# Altium schematic sheet Sheet2.SchDoc
size A3
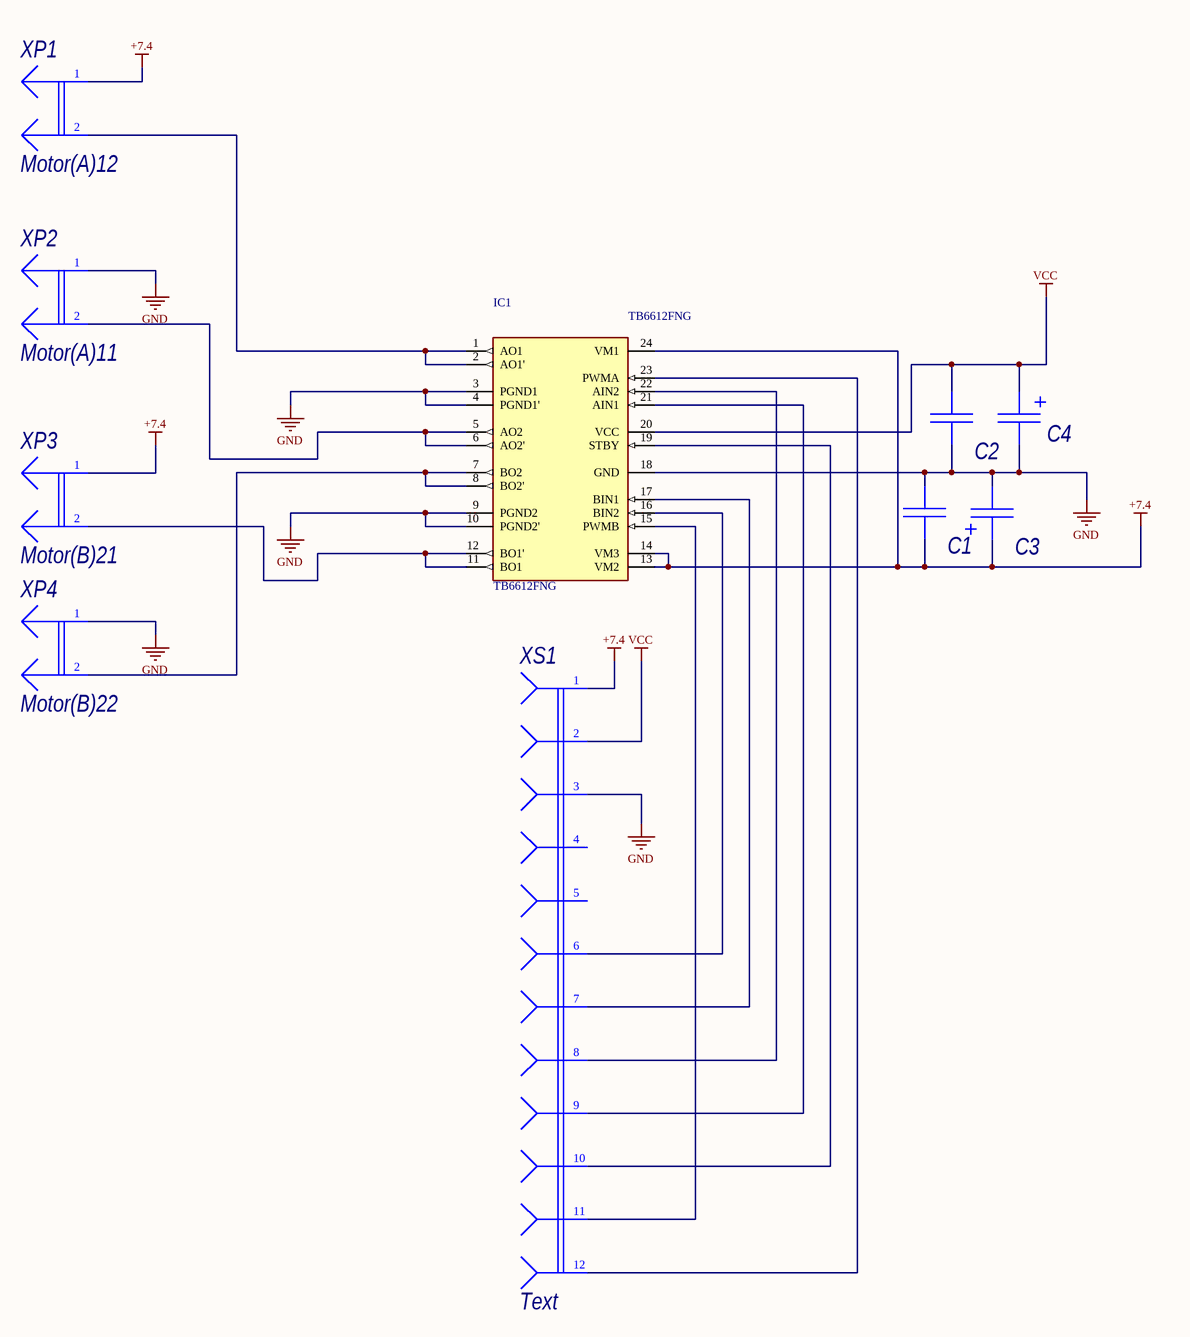
[diagram p0: Sheet2.SchDoc]

## Parts
C1  Capacitor  [C0603]  (value not drawn)
C2  Capacitor  [C0603]  (value not drawn)
C3  Capacitor-T  [C3216-p]  (value not drawn)
C4  Capacitor-T  [C3216-p]  (value not drawn)
IC1  TB6612FNG  [SSOP24]
XP1  Motor(A)12  [PLS-2]
XP2  Motor(A)11  [PLS-2]
XP3  Motor(B)21  [PLS-2]
XP4  Motor(B)22  [PLS-2]
XS1  Text  [PBS-12]

## Nets
+7.4: C1.1 C3.1 IC1.13(VM2) IC1.14(VM3) IC1.24(VM1) XP1.1 XP3.1 XS1.1
GND: C1.2 C2.1 C3.2 C4.2 IC1.3(PGND1) IC1.4(PGND1') IC1.9(PGND2) IC1.10(PGND2') IC1.18(GND) XP2.1 XP4.1 XS1.3
VCC: C2.2 C4.1 IC1.20(VCC) XS1.2
NetIC1_1: IC1.1(AO1) IC1.2(AO1') XP1.2
NetIC1_5: IC1.5(AO2) IC1.6(AO2') XP2.2
NetIC1_7: IC1.7(BO2) IC1.8(BO2') XP4.2
NetIC1_11: IC1.11(BO1) IC1.12(BO1') XP3.2
NetIC1_15: IC1.15(PWMB) XS1.11
NetIC1_16: IC1.16(BIN2) XS1.6
NetIC1_17: IC1.17(BIN1) XS1.7
NetIC1_19: IC1.19(STBY) XS1.10
NetIC1_21: IC1.21(AIN1) XS1.9
NetIC1_22: IC1.22(AIN2) XS1.8
NetIC1_23: IC1.23(PWMA) XS1.12

Not connected (* = marked no-connect by the designer): XS1 4 5

## Library data of the parts
C1 C2 = GRM188R71C104KA01D: 0.1 uF; Manufacturer: Murata; Type: Конденсатор; ID: 131; Value: 0.1uF; Voltage: 16V; Tolerance: ±10%; Dielectric Type: X7R; Application Category: 1; Working Temperature Min: -55°С; Working Temperature Max: +125°С; Published: 18.05.2010; Publisher: Andrew Danich; Part Number: GRM188R71C104KA01D; Footprint: 0603
C3 C4 = T491A106K006AT: 10 uF; Manufacturer: Kemet; Type: Конденсатор; ID: 25; Value: 10uF; Voltage: 6.3V; Tolerance: ±10%; ESR: 4ohm; Leakage Current: 600nA; Application Category: 1; Working Temperature Min: -55°С; Working Temperature Max: +125°С; Published: 23.04.2010; Publisher: Andrew Danich; Part Number: T491A106K006AT; Footprint: A
IC1 = TB6612FNG: Motor Driver Power MOSFET Parallel 24-SSOP; MF: Toshiba; Check_prices: https://www.snapeda.com/parts/TB6612FNG/Toshiba/view-part/6765825/?ref=eda; Availability: In Stock; Price: None; Package: None; Value: *; SnapEDA_Link: https://www.snapeda.com/parts/TB6612FNG/Toshiba/view-part/6765825/?ref=snap; Purchase-URL: https://pricing.snapeda.com/search/part/TB6612FNG/?ref=eda; MP: TB6612FNG
XP1-XP4 = PLS-2: Value: PLS-2; ID: 1; Limit Voltage: 250V; Limit Current: 3A; Connector Type: Male; Resistance: 15momh; Surface Finish: Gold; Pitch: 2.54mm; Published: 07.03.2013; Publisher: Andrew Danich; Type: Вилка; Part Number: PLS-2; Pins: 2
XS1 = PBS-12: Value: Connector; ID: 63; Published: 07.03.2013; Publisher: Andrew Danich; Type: Розетка; Part Number: PBS-12